# Altium project NODE_ABZ.PrjPcb (part 1 of 2)
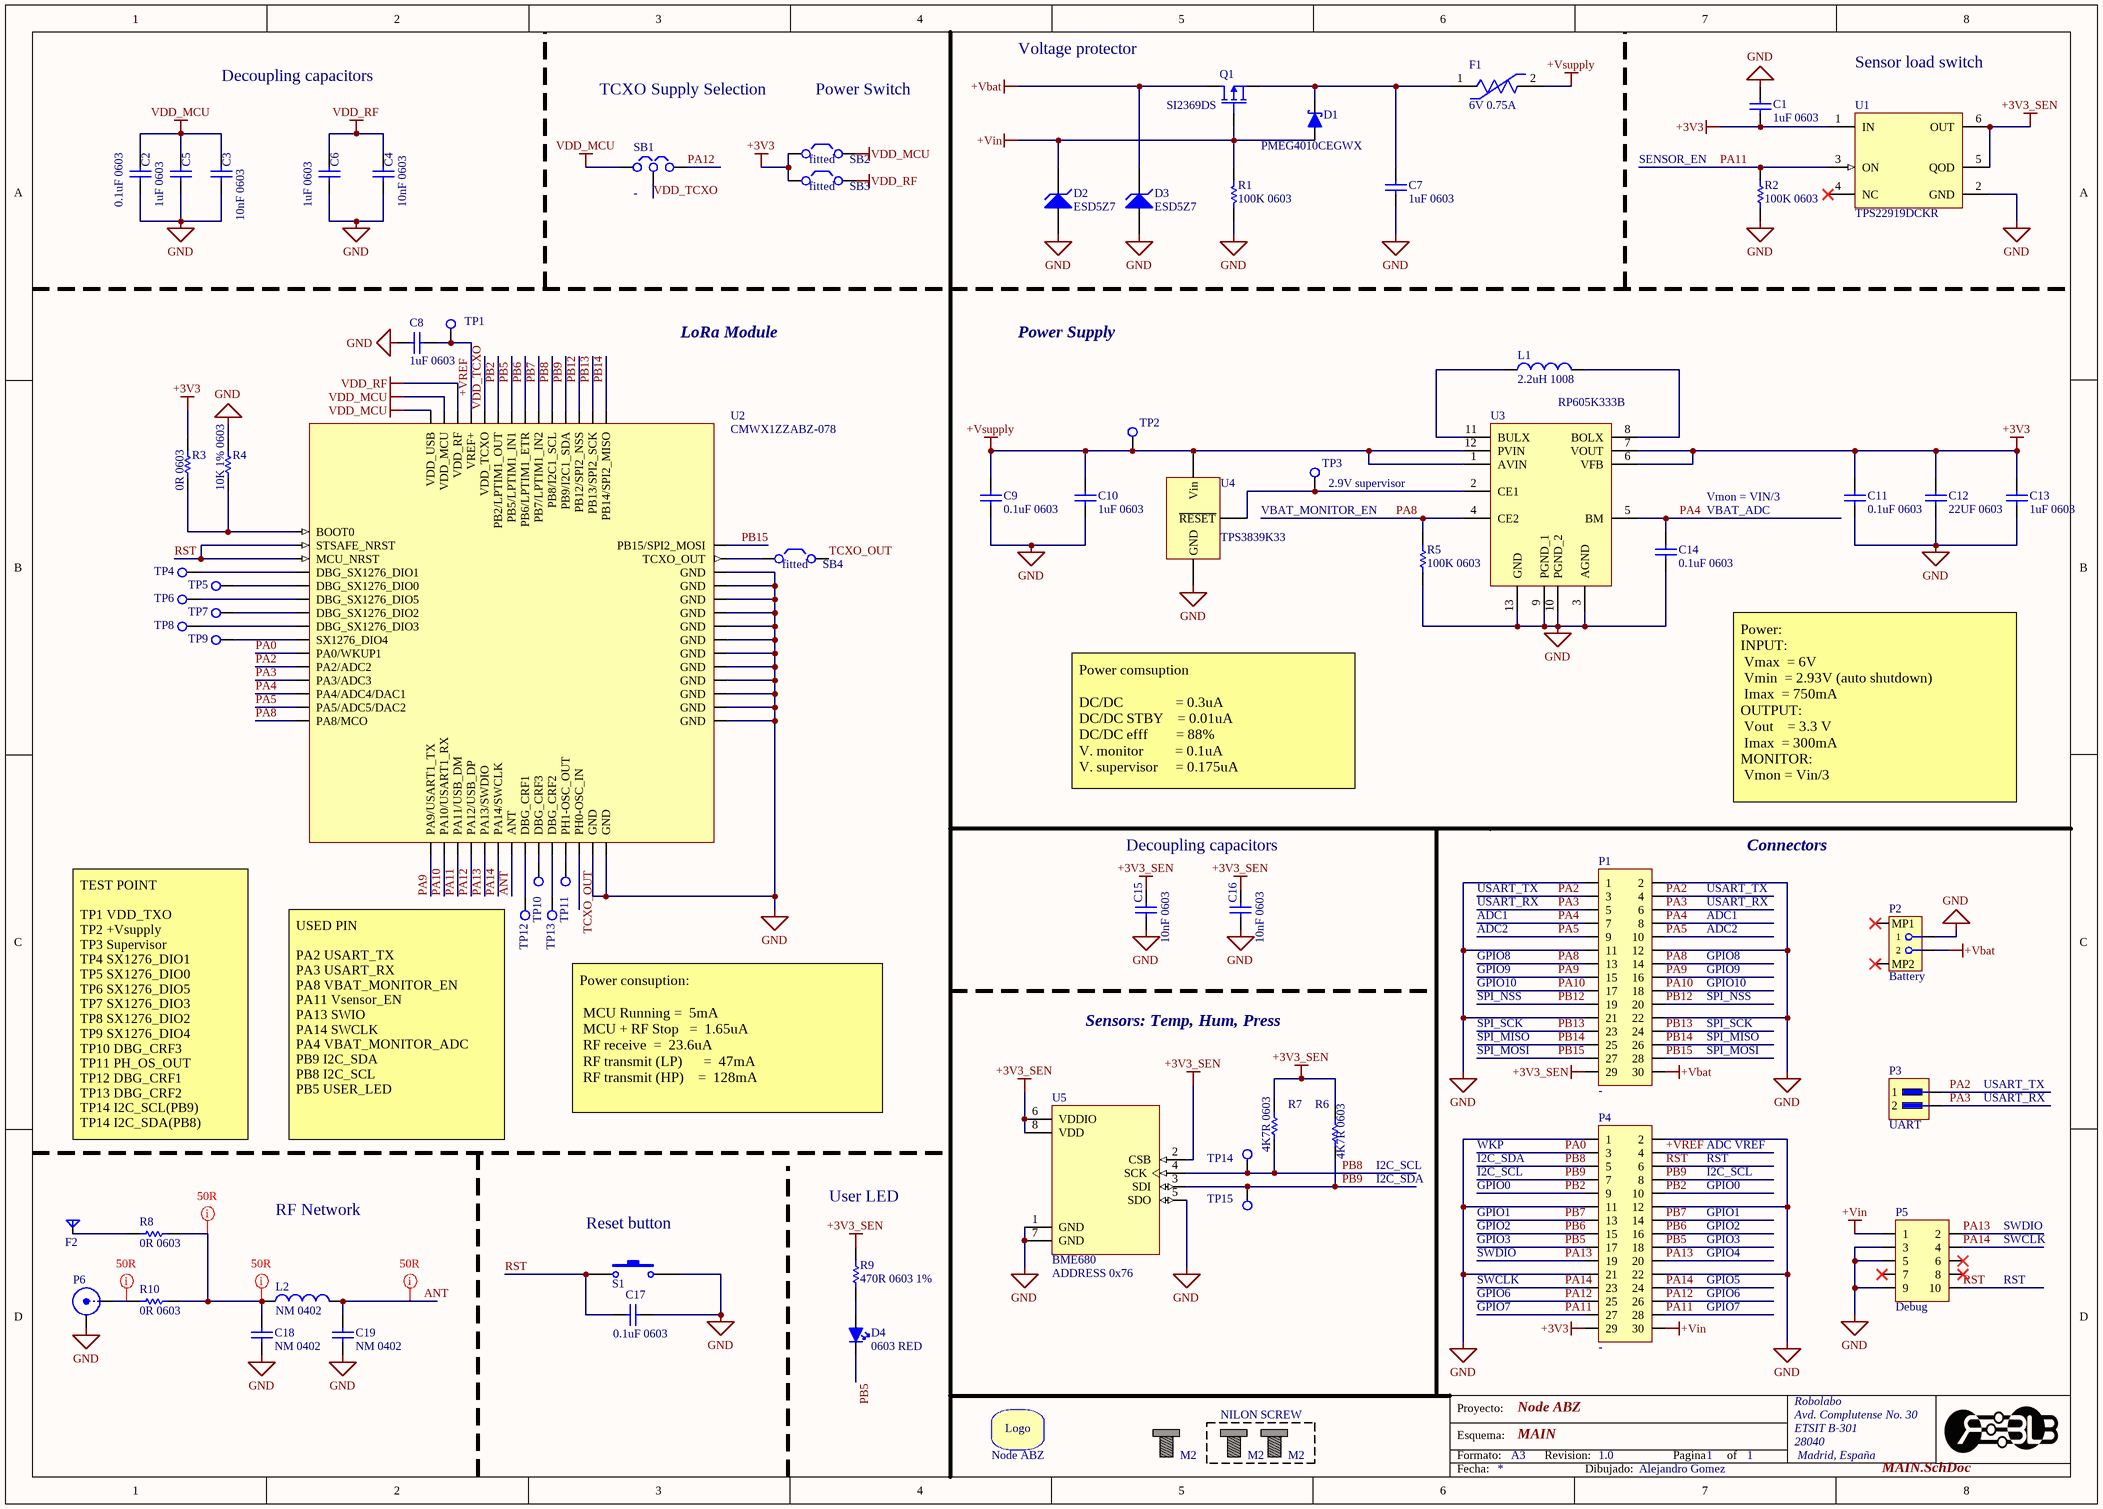
[diagram p0: MAIN.SchDoc]
title: Node ABZ
1 sheet, 73 parts. Net scope: global (net labels, ports and power ports of the same name join across sheets).
Board file: NODE_ABZ.PcbDoc

## Sheet MAIN.SchDoc: Node ABZ
size A3; DrawnBy: Alejandro Gomez; Organization: Robolabo; Address1: Avd. Complutense No. 30; Address2: ETSIT B-301; Address3: 28040; Address4: Madrid, España; Revision: 1.0; SheetNumber: 1; SheetTotal: 1; PageSize: A3; SheetName: MAIN

### Parts
C1  1uF 0603  [CAP_SMD_0603]
C2  0.1uF 0603  [CAP_SMD_0603]
C3  10nF 0603  [CAP_SMD_0603]
C4  10nF 0603  [CAP_SMD_0603]
C5  1uF 0603  [CAP_SMD_0603]
C6  1uF 0603  [CAP_SMD_0603]
C7  1uF 0603  [CAP_SMD_0603]
C8  1uF 0603  [CAP_SMD_0603]
C9  0.1uF 0603  [CAP_SMD_0603]
C10  1uF 0603  [CAP_SMD_0603]
C11  0.1uF 0603  [CAP_SMD_0603]
C12  22UF 0603  [CAP_SMD_0603]
C13  1uF 0603  [CAP_SMD_0603]
C14  0.1uF 0603  [CAP_SMD_0603]
C15  10nF 0603  [CAP_SMD_0603]
C16  10nF 0603  [CAP_SMD_0603]
C17  0.1uF 0603  [CAP_SMD_0603]
C18  NM 0402  [CAP_SMD_0402]  (no BOM)
C19  NM 0402  [CAP_SMD_0402]  (no BOM)
D1  PMEG4010CEGWX  [SODFL358X130-2N]
D2  ESD5Z7  [SODFL160X70-2N]
D3  ESD5Z7  [SODFL160X70-2N]
D4  0603 RED  [DIODE_LED_SMD_0603]
F1  6V 0.75A  [FP-0ZCK0075FF2E-MFG]
F2  Helical 868-915Mhz  [Helical_868-915MHZ]  (value not drawn)  (no BOM)
L1  2.2uH 1008  [IND_SMD_1008]
L2  NM 0402  [IND_SMD_0402]  (no BOM)
logo1  Node ABZ  [Robolabo10x25]  (no BOM)
P1  -  [CONN-2X15-1.27-MALE-RECT-SMD]  (no BOM)
P2  Battery  [JST- S2B-PH-SM4-TB(LF)(SN)-2_V]
P3  UART  [CONN-1X2-2.54-PCB]  (no BOM)
P4  -  [CONN-2X15-1.27-MALE-RECT-SMD]  (no BOM)
P5  Debug  [CONN-2X5-1.27-PCB]  (no BOM)
P6  SMA  [ULFConnector]  (value not drawn)
Q1  SI2369DS  [SOT95P237X120-3N]
R1  100K 0603  [RES_SMD_0603]
R2  100K 0603  [RES_SMD_0603]
R3  0R 0603  [RES_SMD_0603]
R4  10K 1% 0603  [RES_SMD_0603]
R5  100K 0603  [RES_SMD_0603]
R6  4K7R 0603  [RES_SMD_0603]
R7  4K7R 0603  [RES_SMD_0603]
R8  0R 0603  [RED_SMD_0402]
R9  470R 0603 1%  [RES_SMD_0603]
R10  0R 0603  [RED_SMD_0402]
S1  SPST 4.6x2.8mm  [KMR4_CK_SWITCH]  (value not drawn)
SB1  -  [0603_SB_3P]  (no BOM)
SB2  fitted  [0603_SB_2P]  (no BOM)
SB3  fitted  [0603_SB_2P]  (no BOM)
SB4  fitted  [0603_SB_2P]  (no BOM)
screw1  M2  [M2]
screw2  M2  [M2_NOPAD]
screw3  M2  [M2_NOPAD]
TP1  -  [TP_1MM]  (value not drawn)  (no BOM)
TP2  -  [TP_1MM]  (value not drawn)  (no BOM)
TP3  -  [TP_1MM]  (value not drawn)  (no BOM)
TP4  -  [TP_1MM]  (value not drawn)  (no BOM)
TP5  -  [TP_1MM]  (value not drawn)  (no BOM)
TP6  -  [TP_1MM]  (value not drawn)  (no BOM)
TP7  -  [TP_1MM]  (value not drawn)  (no BOM)
TP8  -  [TP_1MM]  (value not drawn)  (no BOM)
TP9  -  [TP_1MM]  (value not drawn)  (no BOM)
TP10  -  [TP_1MM]  (value not drawn)  (no BOM)
TP11  -  [TP_1MM]  (value not drawn)  (no BOM)
TP12  -  [TP_1MM]  (value not drawn)  (no BOM)
TP13  -  [TP_1MM]  (value not drawn)  (no BOM)
TP14  -  [TP_1MM]  (value not drawn)  (no BOM)
TP15  -  [TP_1MM]  (value not drawn)  (no BOM)
U1  TPS22919DCKR  [FP-DCK0006A-IPC_B]
U2  CMWX1ZZABZ-078  [XCVR_CMWX1ZZABZ-078]
U3  RP605K333B  [SON50P270X300X60-13N]
U4  TPS3839K33  [SOT95P237X120-3N]
U5  BME680  [PSON80P300X300X100-8N]

### Blocks framed on the sheet
NILON SCREW: screw2 screw3

### Nets
+3V3: C1.2 C11.2 C12.2 C13.2 P4.29 R3.2 SB2.1(C1) SB3.1(C1) U1.1(IN) U3.6(VFB) U3.7(VOUT)
+3V3_SEN: C15.2 C16.2 P1.29 R6.2 R7.2 R9.2 U1.5(QOD) U1.6(OUT) U5.2(CSB) U5.6(VDDIO) U5.8(VDD)
+Vbat: D3.2(K) P1.30 P2.2 Q1.3(D)
+Vin: D1.1(A) D2.2(K) P4.30 P5.1 Q1.1(G) R1.1
+Vsupply: C9.2 C10.2 F1.2 TP2.1(-) U3.1(AVIN) U3.12(PVIN) U4.3(Vin)
GND: C1.1 C2.1 C3.1 C4.1 C5.1 C6.1 C7.1 C8.2 C9.1 C10.1 C11.1 C12.1 C13.1 C14.1 C15.1 C16.1 C17.2 C18.1 C19.1 D2.1(A) D3.1(A) P1.1 P1.2 P1.11 P1.12 P1.21 P1.22 P2.1 P4.1 P4.2 P4.11 P4.12 P4.21 P4.22 P5.3 P5.5 P5.9 P6.2(Y) R1.2 R2.1 R4.2 R5.1 S1.2 U1.2(GND) U2.3(GND) U2.7(GND) U2.25(GND) U2.27(GND) U2.44(GND) U2.49(GND) U2.50(GND) U2.51(GND) U2.52(GND) U2.53(GND) U2.54(GND) U2.55(GND) U2.56(GND) U2.57(GND) U3.3(AGND) U3.9(PGND_1) U3.10(PGND_2) U3.13(GND) U4.1(GND) U5.1(GND) U5.5(SDO) U5.7(GND)
VDD_MCU: C2.2 C3.2 C5.2 SB1.1(C1) SB2.2(C2) U2.4(VDD_USB) U2.5(VDD_MCU)
VDD_RF: C4.2 C6.2 SB3.2(C2) U2.6(VDD_RF)
+VREF: C8.1 P4.4 TP1.1(-) U2.32(VREF+)
ANT: C19.2 L2.2 U2.26(ANT)
PA0: P4.3 U2.33(PA0/WKUP1)
PA2: P1.3 P1.4 P3.1 U2.24(PA2/ADC2)
PA3: P1.5 P1.6 P3.2 U2.23(PA3/ADC3)
PA4: C14.2 P1.7 P1.8 U2.22(PA4/ADC4/DAC1) U3.5(BM)
PA5: P1.9 P1.10 U2.21(PA5/ADC5/DAC2)
PA8: P1.13 P1.14 R5.2 U2.20(PA8/MCO) U3.4(CE2)
PA9: P1.15 P1.16 U2.19(PA9/USART1_TX)
PA10: P1.17 P1.18 U2.18(PA10/USART1_RX)
PA11: P4.27 P4.28 R2.2 U1.3(ON) U2.2(PA11/USB_DM)
PA12: P4.25 P4.26 SB1.3(C2) U2.1(PA12/USB_DP)
PA13: P4.19 P4.20 P5.2 U2.41(PA13/SWDIO)
PA14: P4.23 P4.24 P5.4 U2.42(PA14/SWCLK)
PB2: P4.9 P4.10 U2.37(PB2/LPTIM1_OUT)
PB5: D4.2(K) P4.17 P4.18 U2.40(PB5/LPTIM1_IN1)
PB6: P4.15 P4.16 U2.39(PB6/LPTIM1_ETR)
PB7: P4.13 P4.14 U2.38(PB7/LPTIM1_IN2)
PB8: P4.5 R7.1 TP14.1(-) U2.35(PB8/I2C1_SCL) U5.4(SCK)
PB9: P4.7 P4.8 R6.1 TP15.1(-) U2.36(PB9/I2C1_SDA) U5.3(SDI)
PB12: P1.19 P1.20 U2.17(PB12/SPI2_NSS)
PB13: P1.23 P1.24 U2.16(PB13/SPI2_SCK)
PB14: P1.25 P1.26 U2.15(PB14/SPI2_MISO)
PB15: P1.27 P1.28 U2.14(PB15/SPI2_MOSI)
RST: C17.1 P4.6 P5.10 S1.1 U2.31(STSAFE_NRST) U2.34(MCU_NRST)
TCXO_OUT: SB4.2(C2) U2.46(PH0-OSC_IN)
VDD_TCXO: SB1.2(C2) U2.48(VDD_TCXO)
NetC7_2: C7.2 D1.2(K) F1.1 Q1.2(S)
NetC18_2: C18.2 L2.1 R8.2 R10.2
NetD4_1: D4.1(A) R9.1
NetF2_1: F2.1 R8.1
NetL1_1: L1.1 U3.11(BULX)
NetL1_2: L1.2 U3.8(BOLX)
NetP6_1: P6.1(X) R10.1
NetR3_1: R3.1 R4.1 U2.43(BOOT0)
NetSB4_1: SB4.1(C1) U2.47(TCXO_OUT)
NetTP3_1: TP3.1(-) U3.2(CE1) U4.2(~{RESET})
NetTP4_1: TP4.1(-) U2.12(DBG_SX1276_DIO1)
NetTP5_1: TP5.1(-) U2.13(DBG_SX1276_DIO0)
NetTP6_1: TP6.1(-) U2.11(DBG_SX1276_DIO5)
NetTP7_1: TP7.1(-) U2.8(DBG_SX1276_DIO2)
NetTP8_1: TP8.1(-) U2.9(DBG_SX1276_DIO3)
NetTP9_1: TP9.1(-) U2.10(SX1276_DIO4)
NetTP10_1: TP10.1(-) U2.29(DBG_CRF3)
NetTP11_1: TP11.1(-) U2.45(PH1-OSC_OUT)
NetTP12_1: TP12.1(-) U2.28(DBG_CRF1)
NetTP13_1: TP13.1(-) U2.30(DBG_CRF2)

Not connected (* = marked no-connect by the designer): P2 MP1* MP2*; P5 6* 7* 8*; U1 4(NC)*

### Layout directives
net class 50R; rule Width Constraint [Pref Impedance = 50.00ohms    Min Impedance = 50.00ohms    Max Impedance = 50.00ohms]: ANT, NetC18_2, NetP6_1

### Notes on the sheet
- Decoupling capacitors
- TCXO Supply Selection
- Power Switch
- Voltage protector
- Sensor load switch
- SENSOR_EN
- LoRa Module
- Power Supply
- VBAT_MONITOR_EN
- (near TP3) 2.9V supervisor
- Vmon = VIN/3
- (near C14) VBAT_ADC
- Power comsuption
  DC/DC               = 0.3uA
  DC/DC STBY    = 0.01uA
  DC/DC efff        = 88%
  V. monitor         = 0.1uA
  V. supervisor     = 0.175uA
- Power:
  INPUT:
  Vmax  = 6V
  Vmin  = 2.93V (auto shutdown)
  Imax  = 750mA
  OUTPUT:
  Vout    = 3.3 V
  Imax  = 300mA
  MONITOR:
  Vmon = Vin/3
- Connectors
- USART_TX
- USART_RX
- ADC1
- ADC2
- GPIO8
- GPIO9
- GPIO10
- Sensors: Temp, Hum, Press
- SPI_NSS
- SPI_SCK
- SPI_MISO
- SPI_MOSI
- Power consuption:
  MCU Running	=  5mA
  MCU + RF Stop  	=  1.65uA
  RF receive 	=  23.6uA
  RF transmit (LP)     	=  47mA
  RF transmit (HP)   	=  128mA
- TEST POINT
  TP1	VDD_TXO
  TP2	+Vsupply
  TP3	Supervisor
  TP4	SX1276_DIO1
  TP5	SX1276_DIO0
  TP6	SX1276_DIO5
  TP7	SX1276_DIO3
  TP8	SX1276_DIO2
  TP9	SX1276_DIO4
  TP10	DBG_CRF3
  TP11	PH_OS_OUT
  TP12	DBG_CRF1
  TP13	DBG_CRF2
  TP14	I2C_SCL(PB9)
  TP14	I2C_SDA(PB8)
- (near TP12) USED PIN
  PA2	USART_TX
  PA3	USART_RX
  PA8	VBAT_MONITOR_EN
  PA11	Vsensor_EN
  PA13	SWIO
  PA14	SWCLK
  PA4	VBAT_MONITOR_ADC
  PB9	I2C_SDA
  PB8	I2C_SCL
  PB5	USER_LED
- (near R6) I2C_SCL
- (near R6) I2C_SDA
- WKP
- I2C_SCL
- I2C_SDA
- GPIO0
- ADC VREF
- RST
- RF Network
- (near S1) Reset button
- User LED
- GPIO1
- GPIO2
- GPIO3
- SWDIO
- GPIO4
- SWCLK
- (near U5) ADDRESS 0x76
- GPIO6
- GPIO7
- GPIO5
- Proyecto:
- Formato:
- Esquema:
- Revision:
- Pagina
- of
- Fecha:
- Dibujado:
- (in symbol Robolabo) Logo